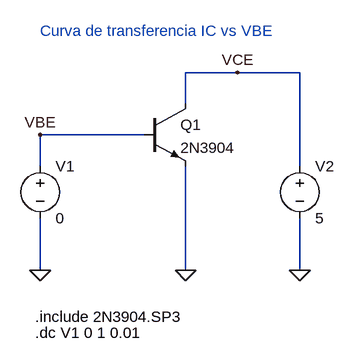
[diagram p0: schematic sim_bjt_transfer.asc]
sim_bjt_transfer.asc, the LTspice schematic file:
Version 4
SHEET 1 880 680
WIRE 336 -48 256 -48
WIRE 432 -48 336 -48
WIRE 256 0 256 -48
WIRE 192 48 32 48
WIRE 32 96 32 48
WIRE 432 96 432 -48
WIRE 32 256 32 176
WIRE 256 256 256 96
WIRE 432 256 432 176
FLAG 32 256 0
FLAG 432 256 0
FLAG 256 256 0
FLAG 32 48 VBE
FLAG 336 -48 VCE
SYMBOL voltage 32 80 R0
SYMATTR InstName V1
SYMATTR Value 0
SYMBOL npn 192 0 R0
SYMATTR InstName Q1
SYMATTR Value 2N3904
SYMBOL voltage 432 80 R0
SYMATTR InstName V2
SYMATTR Value 5
TEXT 32 -112 Left 2 ;Curva de transferencia IC vs VBE
TEXT 24 328 Left 2 !.include 2N3904.SP3
TEXT 24 352 Left 2 !.dc V1 0 1 0.01

The netlist it stands for:
* sim_bjt_transfer.asc
V1 VBE 0 0
Q1 VCE VBE 0 0 2N3904
V2 VCE 0 5
.model NPN NPN
.model PNP PNP
.lib standard.bjt
* Curva de transferencia IC vs VBE
.include 2N3904.SP3
.dc V1 0 1 0.01
.backanno
.end

* Results of the author's LTspice run, read from the files saved beside the schematic
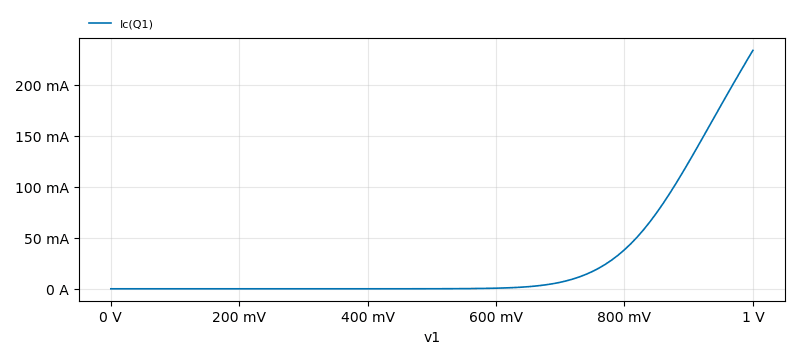
[diagram p1: DC transfer characteristic of sim_bjt_transfer.asc, plotted from the saved traces]
* DC transfer characteristic, 1 run:
*   Ic(Q1): 2.446 nA at v1=0 V, 233.6 mA at v1=1 V, min 2.446 nA, max 233.6 mA